# EAGLE design WifiWeatherGuy (EAGLE 7.5.0)
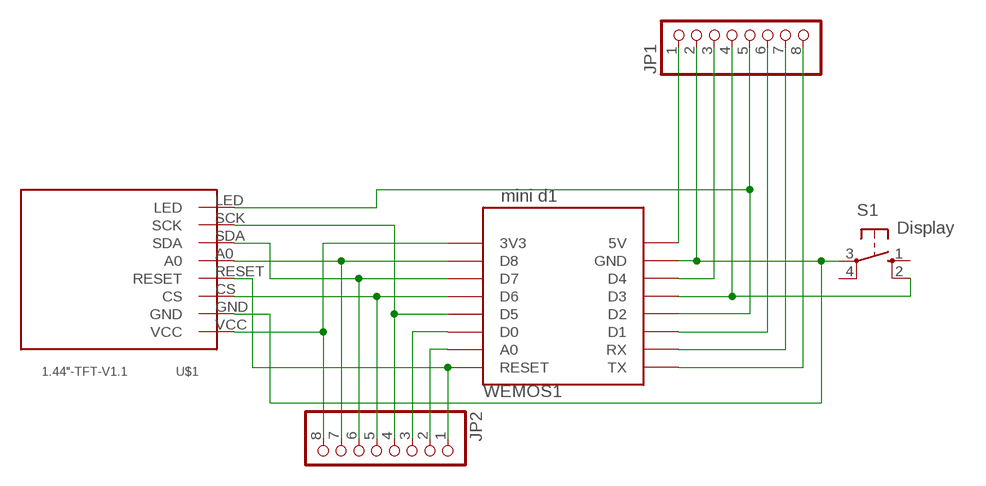
[diagram p0: schematic, sheet 1]

## Parts
JP1  PINHD-1X8  [1X08]
JP2  PINHD-1X8  [1X08]
S1  Display  10-XX  [B3F-10XX]
U$1  1.44"-TFT-V1.1  [1.44-TFT-V1.1]
WEMOS1  mini d1  WEMOS-D1-MINI  [WEMOS-D1-MINI]

## Nets
N$1: JP2.8 U$1.VCC WEMOS1.3V3
N$2: JP2.5 U$1.CS WEMOS1.D6
N$3: JP2.7 U$1.A0 WEMOS1.D8
N$4: JP2.6 U$1.SDA WEMOS1.D7
N$5: JP2.4 U$1.SCK WEMOS1.D5
N$6: JP1.5 U$1.LED WEMOS1.D2
N$7: JP2.3 WEMOS1.D0
N$8: JP2.1 U$1.RESET WEMOS1.RESET
N$9: JP1.4 S1.2(S1) WEMOS1.D3
N$10: JP1.1 WEMOS1.5V
N$11: JP1.3 WEMOS1.D4
N$12: JP1.6 WEMOS1.D1
N$13: JP1.7 WEMOS1.RX
N$14: JP1.8 WEMOS1.TX
N$15: JP2.2 WEMOS1.A0
N$16: JP1.2 S1.3(P) U$1.GND WEMOS1.GND
Unconnected: S1.1(S) S1.4(P1)

## Library data of the parts
JP1 JP2 = pinhead:PINHD-1X8: PIN HEADER
S1 = switch-omron:10-XX: OMRON SWITCH; MPN: B3F-1000; OC_FARNELL: 176432; OC_NEWARK: 36M3542
U$1 = tft_1.8_1.44_oled_0.96:1.44"-TFT-V1.1
WEMOS1 = esp8266modules:WEMOS-D1-MINI: WeMos.cc D1 mini ESP8266 module

## Board
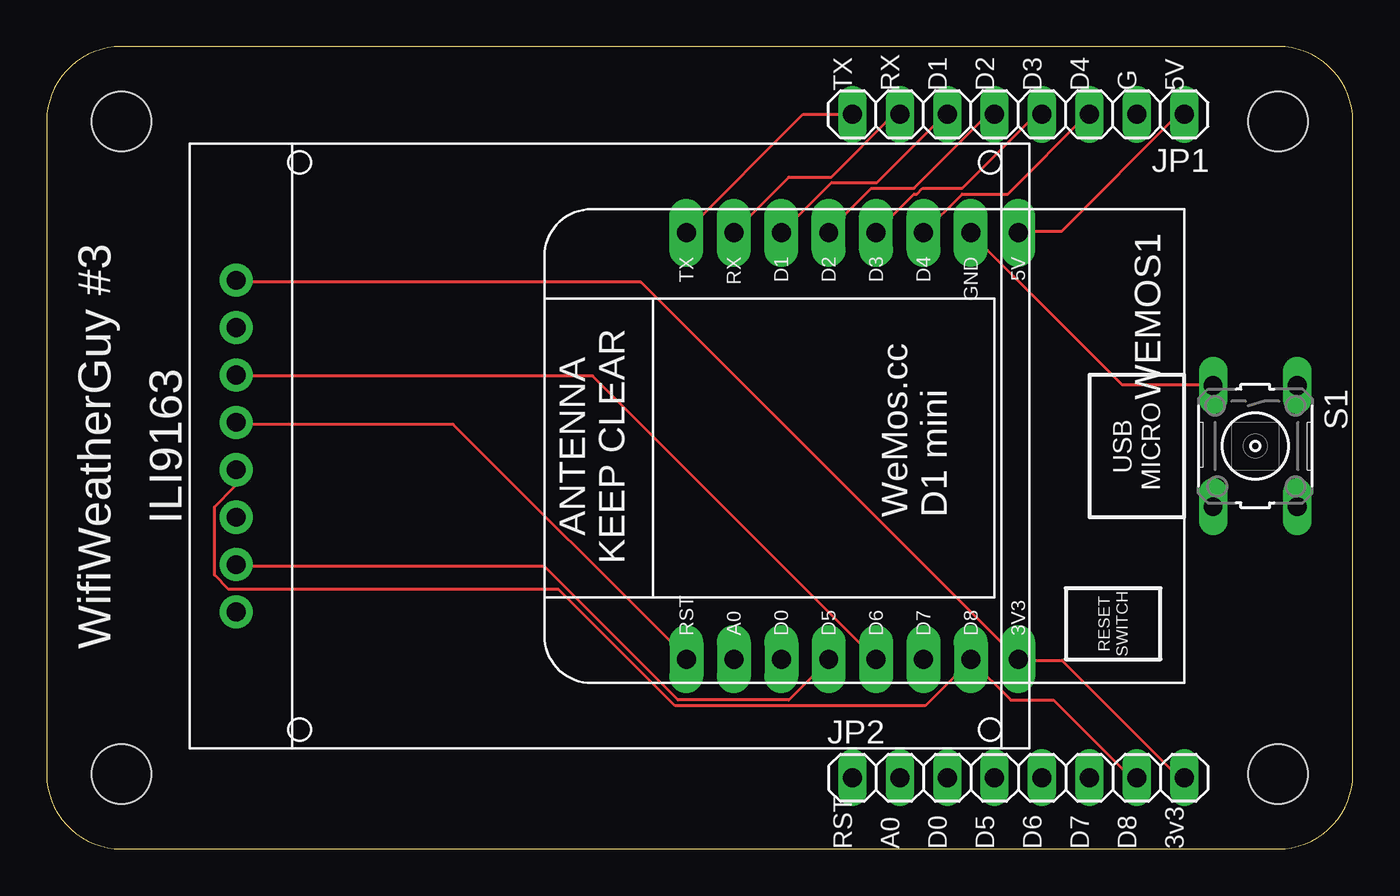
[diagram p1: board, top side]
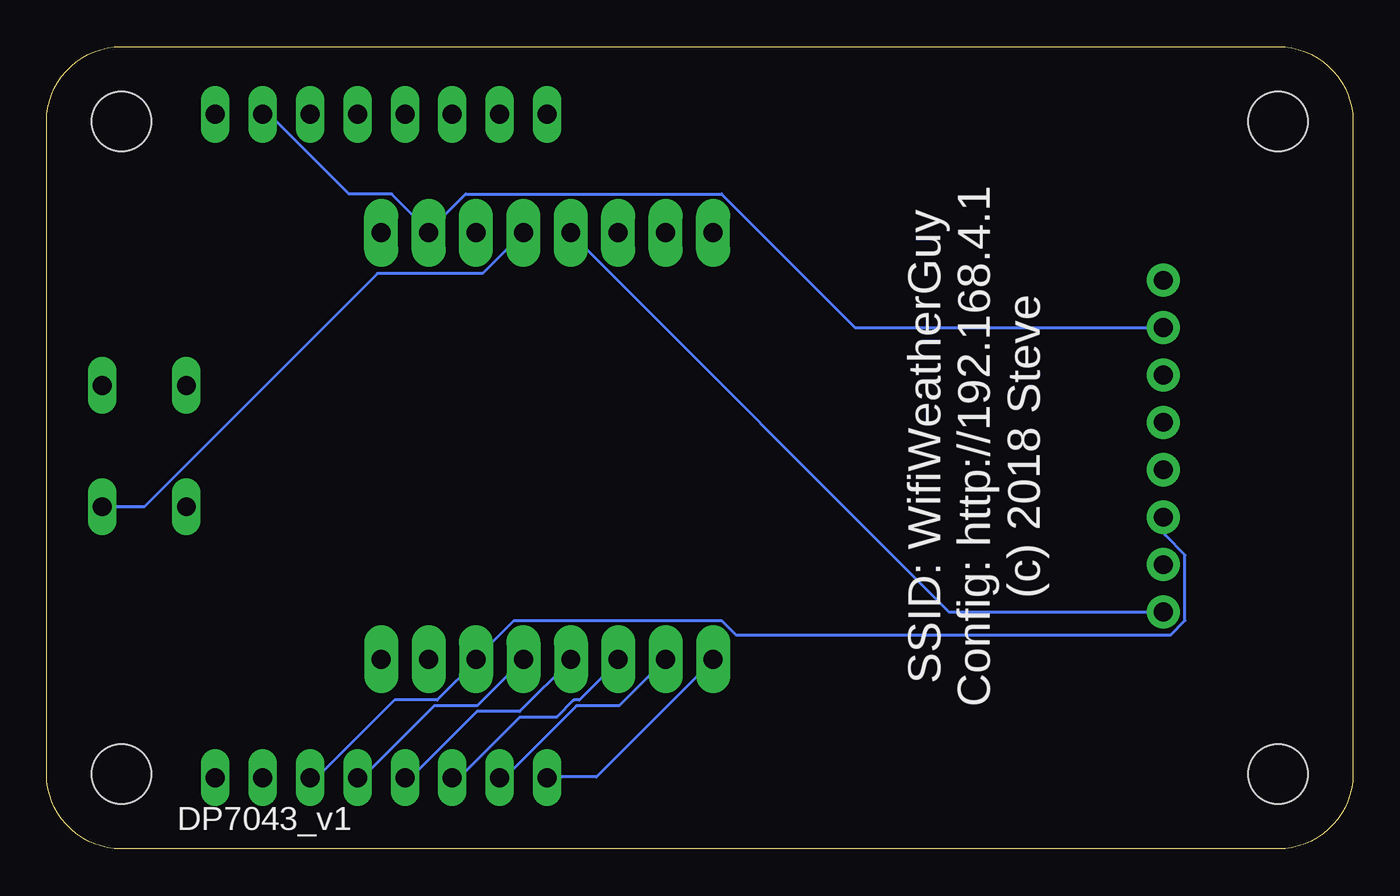
[diagram p2: board, bottom side, seen from below]

Size 70 x 43 mm. Coordinates in mm from the lower left corner, seen from the top.
Copper layers (1*16): Top 0.035mm / dielectric 1.5mm / Bottom 0.035mm
Design rules "SeeedStudio_2layer_DRU_no_angle_20140221": minimum track width 6mil, minimum drill 12mil, track to track 6mil, track to pad 6mil, pad to pad 6mil, via to via 6mil, smd to smd 0mil, copper to edge 10mil, drill to drill 10mil, minimum pad ring 10mil, minimum via ring 6mil, stop-mask expansion 2mil, vias tented up to drill 100mil, thermal gap 10mil

### Footprints (pad centres in the part's own frame; a part is rotated, then mirrored left to right if it is on the bottom)
1X08 = drill 1.016 long: 1 -8.89,0; 2 -6.35,0; 3 -3.81,0; 4 -1.27,0; 5 1.27,0; 6 3.81,0; 7 6.35,0; 8 8.89,0
B3F-10XX = drill 1.016 long: 1 -3.251,2.261; 2 3.251,2.261; 3 -3.251,-2.261; 4 3.251,-2.261
1.44-TFT-V1.1 = drill 1 pad 1.778: A0 0,7.62; CS 0,12.7; GND 0,15.24; LED 0,0; RESET 0,10.16; SCK 0,2.54; SDA 0,5.08; VCC 0,17.78
DP7043_V1 = hole 3.2: 4,4; 66,4; 66,39; 4,39
WEMOS-D1-MINI = drill 1.016 pad 1.829 long: 3V3 -10.16,-10.16; 5V 12.7,-10.16; A0 -10.16,5.08; D0 -10.16,2.54; D1 12.7,2.54; D2 12.7,0; D3 12.7,-2.54; D4 12.7,-5.08; D5 -10.16,0; D6 -10.16,-2.54; D7 -10.16,-5.08; D8 -10.16,-7.62; GND 12.7,-7.62; RESET -10.16,7.62; RX 12.7,5.08; TX 12.7,7.62

### Placement (x,y rotation side)
JP1  52.07,39.37 180 top
JP2  52.07,3.81 0 top
S1  64.77,21.59 270 top
U$1  10.16,12.7 0 top
U$2  [DP7043_V1]  0,0 0 top
WEMOS1  41.91,20.32 90 top

### Tracks (layer width: path | path; a pad name or v marks a point on that pad's centre or on a via)
N$1
  Top 0.152: U$1.VCC 10.21,30.38 31.85,30.38 WEMOS1.3V3 52.12,10.11 54.41,10.11 60.66,3.86 60.96,3.86 JP2.8
N$2
  Top 0.152: WEMOS1.D6 29.26,25.35 10.21,25.35 U$1.CS
  Bottom 0.152: WEMOS1.D6 46.94,7.67 49.23,7.67 53.03,3.86 53.34,3.86 JP2.5
N$3
  Top 0.152: 49.53,10.11 47.09,7.67 33.68,7.67 27.43,13.92 9.75,13.92 8.99,14.68 8.99,18.34 10.06,19.41 10.06,20.32 U$1.A0 | 49.53,10.11 51.66,7.98 53.95,7.98 58.06,3.86 58.37,3.86 JP2.7 | 49.53,10.11 WEMOS1.D8
N$4
  Bottom 0.152: U$1.SDA 10.06,17.73 10.06,16.82 8.99,15.75 8.99,12.24 9.75,11.48 33.07,11.48 33.83,12.24 44.96,12.24 46.94,10.26 WEMOS1.D7 46.94,10.11 49.07,7.98 51.36,7.98 55.47,3.86 55.78,3.86 JP2.6
N$5
  Top 0.152: U$1.SCK 10.21,15.14 26.67,15.14 33.83,7.98 39.78,7.98 41.91,10.11 WEMOS1.D5
  Bottom 0.152: JP2.4 50.75,3.86 50.44,3.86 46.94,7.37 44.65,7.37 41.91,10.11 WEMOS1.D5
N$6
  Top 0.152: JP1.5 50.44,39.37 46.48,35.41 44.2,35.41 41.91,33.12 WEMOS1.D2
  Bottom 0.152: U$1.LED 21.64,12.7 41.91,32.97 WEMOS1.D2
N$7
  Bottom 0.152: JP2.3 48.16,3.86 47.85,3.86 44.65,7.06 42.67,7.06 41.76,7.98 41.45,7.98 39.32,10.11 WEMOS1.D0
N$8
  Top 0.152: U$1.RESET 10.21,22.76 21.79,22.76 34.29,10.26 WEMOS1.RESET
  Bottom 0.152: JP2.1 43.13,3.86 40.54,3.86 34.29,10.11 WEMOS1.RESET
N$9
  Top 0.152: JP1.4 53.03,39.37 49.07,35.41 46.94,35.41 46.63,35.1 46.48,35.1 44.5,33.12 WEMOS1.D3
  Bottom 0.152: WEMOS1.D3 46.63,30.84 52.27,30.84 64.77,18.34 S1.2
N$10
  Top 0.152: JP1.1 60.66,39.37 54.41,33.12 52.12,33.12 WEMOS1.5V
N$11
  Top 0.152: WEMOS1.D4 49.07,35.1 51.51,35.1 55.78,39.37 JP1.3
N$12
  Top 0.152: WEMOS1.D1 42.06,35.71 44.5,35.71 48.16,39.37 JP1.6
N$13
  Top 0.152: JP1.7 45.41,39.37 42.06,36.02 39.78,36.02 36.88,33.12 WEMOS1.RX
N$14
  Top 0.152: JP1.8 40.54,39.37 34.29,33.12 WEMOS1.TX
N$15
  Bottom 0.152: WEMOS1.A0 39.32,7.67 41.6,7.67 45.41,3.86 45.72,3.86 JP2.2
N$16
  Top 0.152: S1.3 62.48,24.89 57.61,24.89 49.53,32.97 WEMOS1.GND
  Bottom 0.152: U$1.GND 26.67,27.94 33.83,35.1 47.55,35.1 49.53,33.12 | JP1.2 58.06,39.37 53.8,35.1 51.51,35.1 49.53,33.12 | 49.53,33.12 WEMOS1.GND

### Text on the board
tPlace: TX | RX | D1 | D2 | D3 | D4 | G | 5V | WifiWeatherGuy #3 | ILI9163 | RST | A0 | D0 | D5 | D6 | D7 | D8 | 3v3
bPlace: SSID: WifiWeatherGuy / Config: http://192.168.4.1 / (c) 2018 Steve